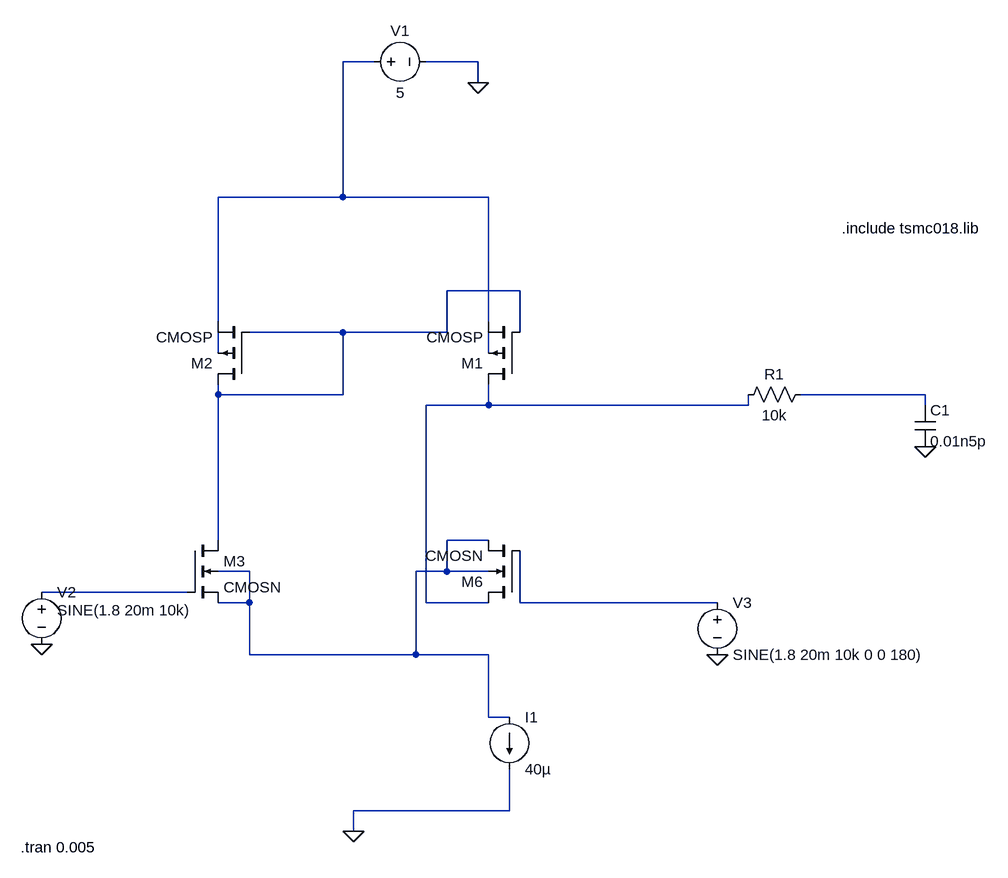
[diagram p0: schematic Draft4.asc]
Draft4.asc, the LTspice schematic file:
Version 4
SHEET 1 2012 680
WIRE 432 -544 384 -544
WIRE 592 -544 512 -544
WIRE 592 -512 592 -544
WIRE 384 -336 384 -544
WIRE 384 -336 192 -336
WIRE 608 -336 384 -336
WIRE 656 -192 544 -192
WIRE 192 -144 192 -336
WIRE 608 -144 608 -336
WIRE 384 -128 240 -128
WIRE 544 -128 544 -192
WIRE 544 -128 384 -128
WIRE 656 -128 656 -192
WIRE 192 -96 192 -128
WIRE 608 -96 608 -128
WIRE 192 -32 192 -48
WIRE 384 -32 384 -128
WIRE 384 -32 192 -32
WIRE 1280 -32 1088 -32
WIRE 608 -16 608 -48
WIRE 608 -16 512 -16
WIRE 1008 -16 1008 -32
WIRE 1008 -16 608 -16
WIRE 1280 -16 1280 -32
WIRE 192 192 192 -32
WIRE 608 192 544 192
WIRE 240 240 192 240
WIRE 544 240 544 192
WIRE 544 240 496 240
WIRE 608 240 544 240
WIRE 144 272 -80 272
WIRE 240 288 240 240
WIRE 240 288 192 288
WIRE 512 288 512 -16
WIRE 608 288 512 288
WIRE 656 288 656 208
WIRE 960 288 656 288
WIRE 240 368 240 288
WIRE 496 368 496 240
WIRE 496 368 240 368
WIRE 608 368 496 368
WIRE 608 464 608 368
WIRE 640 464 608 464
WIRE 640 608 640 544
WIRE 640 608 400 608
WIRE 400 640 400 608
FLAG 400 640 0
FLAG 592 -512 0
FLAG -80 352 0
FLAG 960 368 0
FLAG 1280 48 0
SYMBOL voltage 416 -544 R270
WINDOW 0 32 56 VTop 2
WINDOW 3 -32 56 VBottom 2
WINDOW 123 0 0 Left 0
WINDOW 39 0 0 Left 0
SYMATTR InstName V1
SYMATTR Value 5
SYMBOL voltage -80 256 R0
WINDOW 123 24 124 Left 2
WINDOW 39 0 0 Left 0
WINDOW 3 24 44 Left 2
SYMATTR Value SINE(1.8 20m 10k)
SYMATTR InstName V2
SYMBOL voltage 960 272 R0
WINDOW 123 0 0 Left 0
WINDOW 39 0 0 Left 0
SYMATTR InstName V3
SYMATTR Value SINE(1.8 20m 10k 0 0 180)
SYMBOL cap 1264 -16 R0
SYMATTR InstName C1
SYMATTR Value 0.01n5p
SYMBOL current 640 464 R0
WINDOW 123 0 0 Left 0
WINDOW 39 0 0 Left 0
SYMATTR InstName I1
SYMATTR Value 40µ
SYMBOL cmosn 144 192 R0
SYMATTR InstName M3
SYMATTR Value2 l=0.18u w=1u
SYMBOL cmosn 656 288 R180
SYMATTR InstName M6
SYMATTR Value2 l=0.18u w=10u
SYMBOL cmosp 656 -48 R180
SYMATTR InstName M1
SYMATTR Value2 l=0.18u w=10u
SYMBOL cmosp 240 -48 R180
SYMATTR InstName M2
SYMATTR Value2 l=0.18u w=10u
SYMBOL res 992 -16 R270
WINDOW 0 32 56 VTop 2
WINDOW 3 0 56 VBottom 2
SYMATTR InstName R1
SYMATTR Value 10k
TEXT -112 664 Left 2 !.tran 0.005
TEXT 1152 -288 Left 2 !.include tsmc018.lib

The netlist it stands for:
* Draft4.asc
V1 N001 0 5
V2 N008 0 SINE(1.8 20m 10k)
V3 N009 0 SINE(1.8 20m 10k 0 0 180)
C1 N005 0 0.01n5p
I1 N007 0 40µ
M3 N002 N008 N007 N007 CMOSN l=0.18u w=1u
M6 N006 N009 N007 N007 CMOSN l=0.18u w=10u
M1 N006 N002 N001 N004 CMOSP l=0.18u w=10u
M2 N002 N002 N001 N003 CMOSP l=0.18u w=10u
R1 N006 N005 10k
.model NMOS NMOS
.model PMOS PMOS
.lib standard.mos
.tran 0.005
.include tsmc018.lib
.backanno
.end